# Altium schematic sheet ConnectionMCU.SchDoc
size A3; SheetNumber: 4; SheetTotal: 4
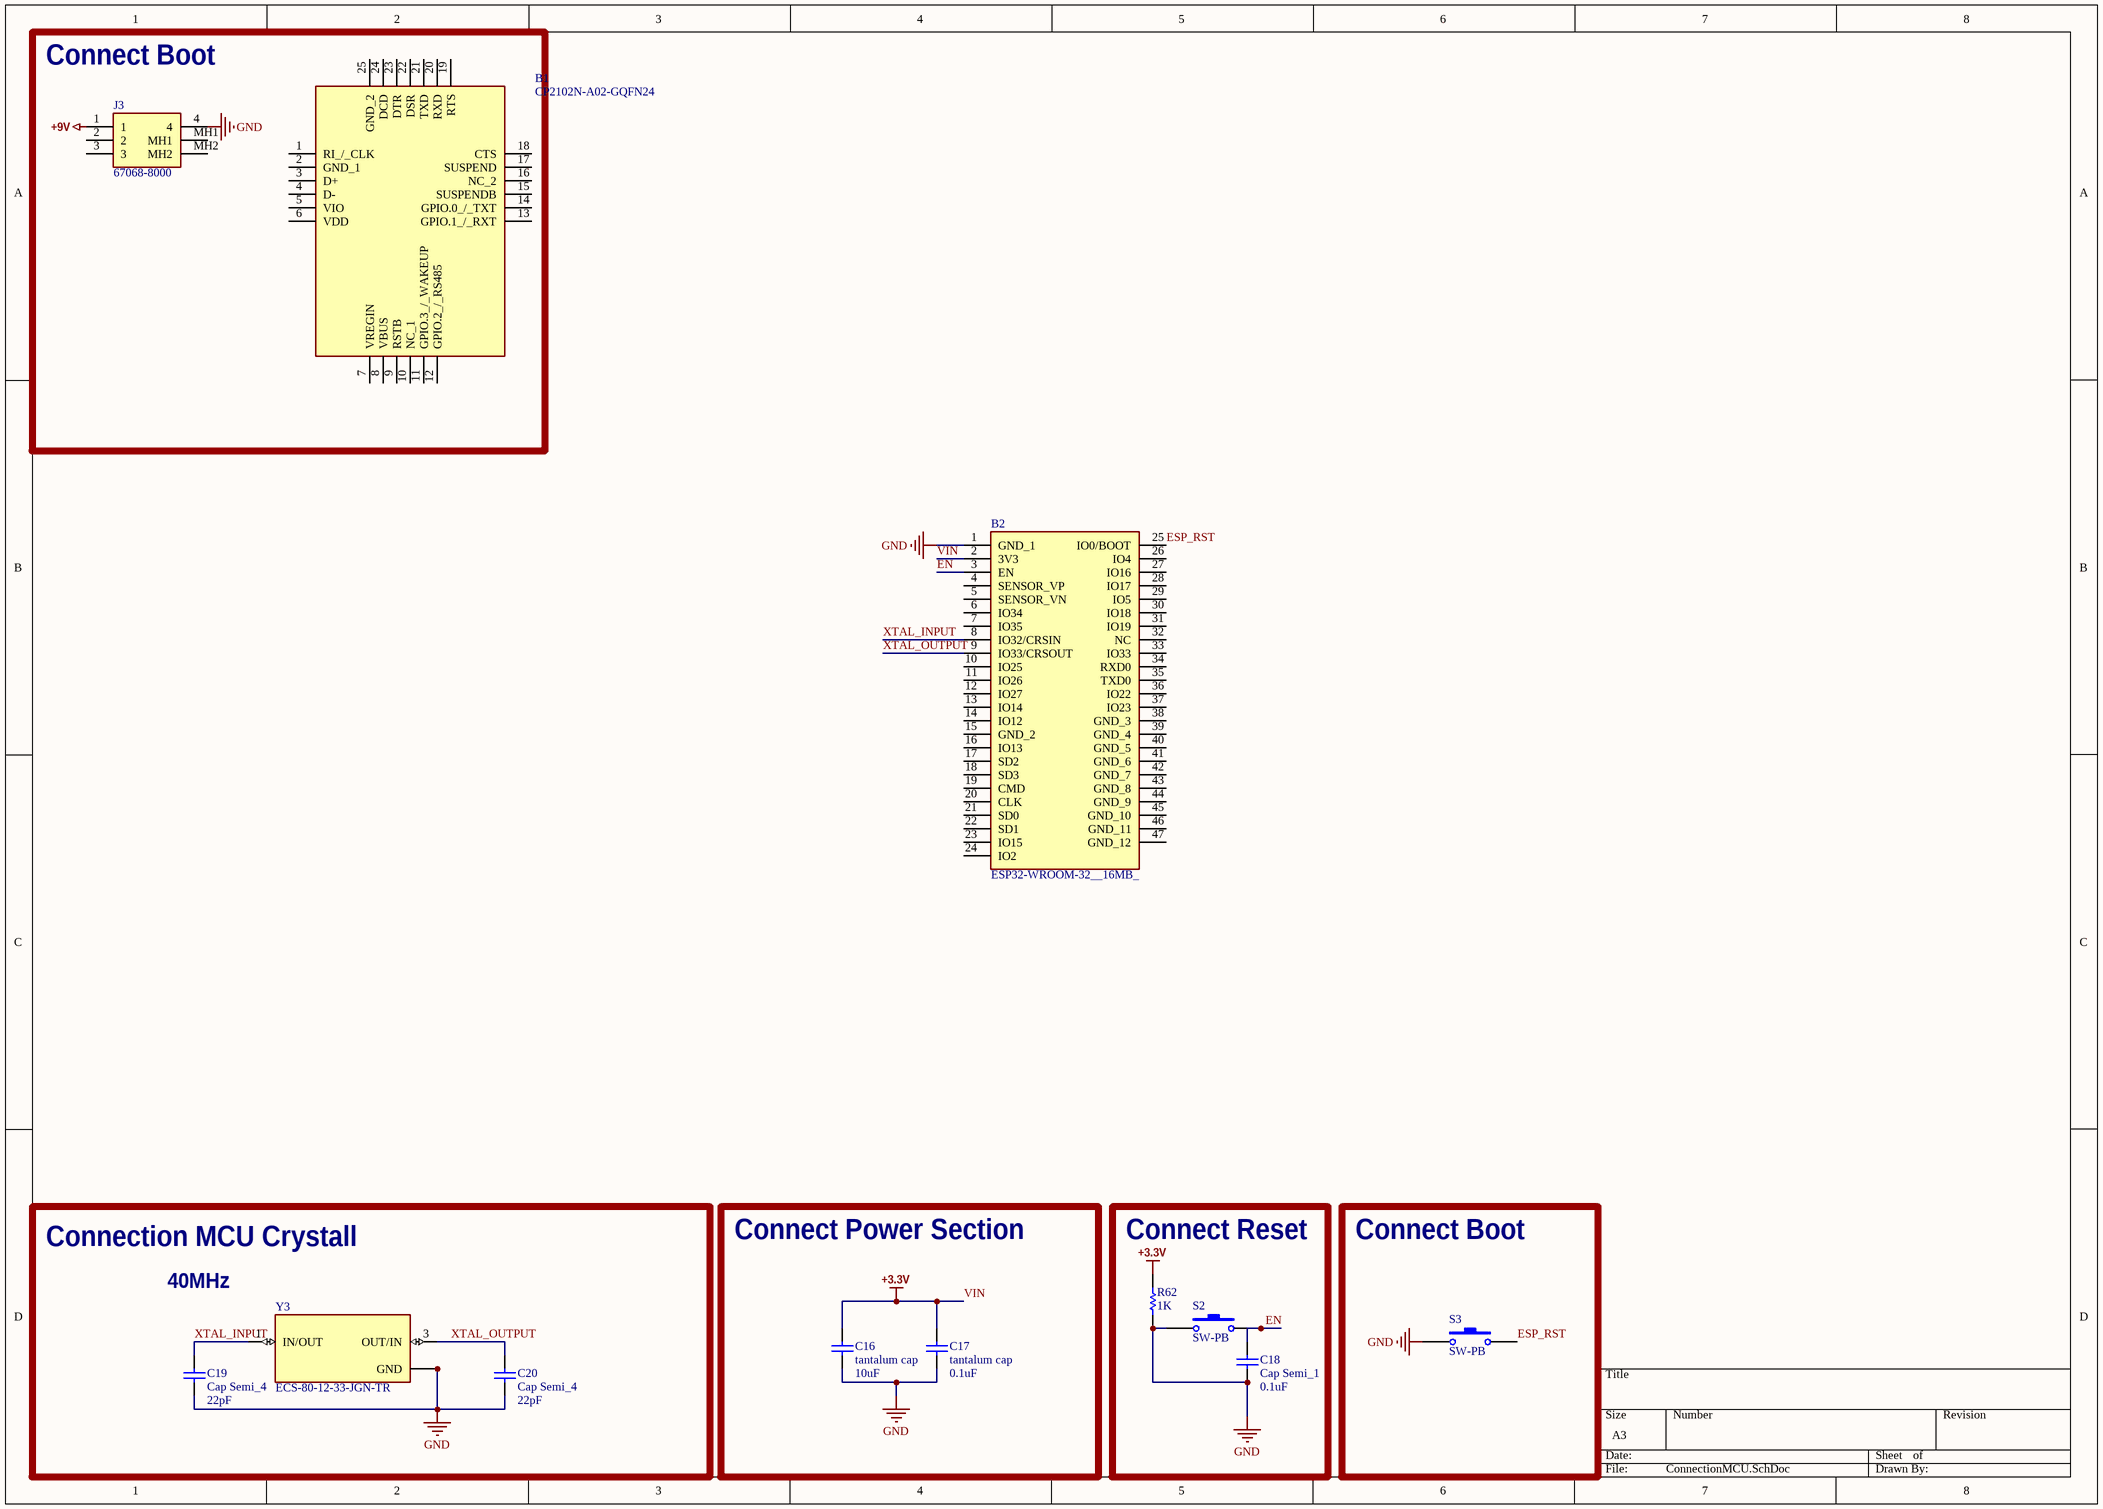
[diagram p0: ConnectionMCU.SchDoc]

## Parts
B1  CP2102N-A02-GQFN24  [QFN50P400X400X80-25N-D]
B2  ESP32-WROOM-32__16MB_  [ESP32WROOM3216MB]
C16  tantalum cap  value 10uF  [C1206tancap]
C17  tantalum cap  value 0.1uF  [C1206tancap]
C18  Cap Semi_1  value 0.1uF  [1608[0603]cap]
C19  Cap Semi_4  value 22pF  [0402cap]
C20  Cap Semi_4  value 22pF  [0402cap]
J3  67068-8000  [670688000]
R62  1K  [MY_0603]
S2  SW-PB  [SPST-2_body]
S3  SW-PB  [SPST-2_body]
Y3  ECS-80-12-33-JGN-TR  [8MHZCrystall]

## Blocks framed on the sheet
Connect Boot: B1 J3
Connection MCU Crystall: C19 C20 Y3
Connect Power Section: C16 C17
Connect Reset: C18 R62 S2
Connect Boot: S3

## Nets
+9V: J3.1
GND: B2.1(GND_1) C16.1 C17.1 C18.1 C19.1 C20.1 J3.4 R62.1 S2.1 S3.1 Y3.2(GND) Y3.4(GND)
VIN: B2.2(3V3) C16.2 C17.2 R62.2  [also labelled +3.3V]
EN: B2.3(EN) C18.2 S2.2
ESP_RST: B2.25(IO0/BOOT) S3.2
XTAL_INPUT: B2.8(IO32/CRSIN) C19.2 Y3.1(IN/OUT)
XTAL_OUTPUT: B2.9(IO33/CRSOUT) C20.2 Y3.3(OUT/IN)

Not connected (* = marked no-connect by the designer): B1 1(RI_/_CLK) 2(GND_1) 3(D+) 4(D-) 5(VIO) 6(VDD) 7(VREGIN) 8(VBUS) 9(RSTB) 10(NC_1) 11(GPIO.3_/_WAKEUP) 12(GPIO.2_/_RS485) 13(GPIO.1_/_RXT) 14(GPIO.0_/_TXT) 15(SUSPENDB) 16(NC_2) 17(SUSPEND) 18(CTS) 19(RTS) 20(RXD) 21(TXD) 22(DSR) 23(DTR) 24(DCD) 25(GND_2); B2 4(SENSOR_VP) 5(SENSOR_VN) 6(IO34) 7(IO35) 10(IO25) 11(IO26) 12(IO27) 13(IO14) 14(IO12) 15(GND_2) 16(IO13) 17(SD2) 18(SD3) 19(CMD) 20(CLK) 21(SD0) 22(SD1) 23(IO15) 24(IO2) 26(IO4) 27(IO16) 28(IO17) 29(IO5) 30(IO18) 31(IO19) 32(NC) 33(IO33) 34(RXD0) 35(TXD0) 36(IO22) 37(IO23) 38(GND_3) 39(GND_4) 40(GND_5) 41(GND_6) 42(GND_7) 43(GND_8) 44(GND_9) 45(GND_10) 46(GND_11) 47(GND_12); J3 2 3 MH1 MH2

## Notes on the sheet
- 40MHz

## Library data of the parts
B1 = CP2102N-A02-GQFN24: USB Interface IC USB to UART bridge - QFN24; Manufacturer_Name: Silicon Labs; Geometry.Height: 0.8mm; Manufacturer_Part_Number: CP2102N-A02-GQFN24; Mouser Part Number: 634-CP2102NA02GQFN24; Mouser Price/Stock: https://www.mouser.co.uk/ProductDetail/Silicon-Labs/CP2102N-A02-GQFN24?qs=u16ybLDytRYKabtL%2FE7DZA%3D%3D; Arrow Part Number: CP2102N-A02-GQFN24; Arrow Price/Stock: https://www.arrow.com/en/products/cp2102n-a02-gqfn24/silicon-labs?region=nac; Datasheet Link: https://componentsearchengine.com/Datasheets/1/CP2102N-A02-GQFN24.pdf
B2 = ESP32-WROOM-32__16MB_: WiFi Modules (802.11); Manufacturer_Name: Espressif Systems; Manufacturer_Part_Number: ESP32-WROOM-32 (16MB); Geometry.Height: 3.2mm; Mouser Part Number: 356-ESPWROOM3216MB; Mouser Price/Stock: https://www.mouser.co.uk/ProductDetail/Espressif-Systems/ESP32-WROOM-32-16MB?qs=w%2Fv1CP2dgqrcPyEPuQvO1A%3D%3D; Arrow Part Number: *; Arrow Price/Stock: *; Datasheet Link: https://www.espressif.com/sites/default/files/documentation/esp32_datasheet_en.pdf
C16 C17 = Cap Semi_6: Capacitor (Semiconductor SIM Model); Published: 8-Jun-2000; LatestRevisionDate: 29-May-2009; LatestRevisionNote: IPC-7351 Footprint Added.; PackageReference: C1206; Publisher: Altium Limited; PackageDescription: Chip Capacitor
C18 = Cap Semi_1: Capacitor (Semiconductor SIM Model); Published: 8-Jun-2000; LatestRevisionDate: 29-May-2009; LatestRevisionNote: IPC-7351 Footprint Added.; PackageReference: C1206; Publisher: Altium Limited; PackageDescription: Chip Capacitor
C19 C20 = Cap Semi_4: Capacitor (Semiconductor SIM Model); Published: 8-Jun-2000; LatestRevisionDate: 29-May-2009; LatestRevisionNote: IPC-7351 Footprint Added.; PackageReference: C1206; Publisher: Altium Limited; PackageDescription: Chip Capacitor
J3 = 67068-8000: USB Connectors USB TYPE B RECEPT. Rt.Angle Gold Flash; Manufacturer_Name: Molex; Geometry.Height: 11mm; Manufacturer_Part_Number: 67068-8000; Mouser Part Number: 538-67068-8000; Mouser Price/Stock: https://www.mouser.co.uk/ProductDetail/Molex/67068-8000?qs=N76qWb2E9MLsLGBiHvIzzg%3D%3D; Arrow Part Number: *; Arrow Price/Stock: *; Datasheet Link: https://www.molex.com/pdm_docs/sd/670688000_sd.pdf
R62 = Res: Standard resistor; ASiD Part Number: Res-AS; Value: 1K
S2 S3 = SW-PB: Switch; Published: 24-Mar-1999; LatestRevisionDate: 17-Jul-2002; LatestRevisionNote: Re-released for DXP Platform.; PackageReference: SPST-2; Publisher: Altium Limited; PackageDescription: Switch; 2 Leads
Y3 = ECS-80-12-33-JGN-TR: 8MHz Â±20ppm Crystal 12pF 400 Ohms 4-SMD, No Lead; Value: 40 MHZ; MF: ECS Inc.; Package: SMD-4 ECS International; MP: ECS-80-12-33-JGN-TR; Availability: Warning; Price: None; SnapEDA_Link: https://www.snapeda.com/parts/ECS-80-12-33-JGN-TR/ECS%20Inc./view-part/4477300/?ref=snap; Mouser-Purchase-URL: https://snapeda.com/shop?store=Mouser&id=4477300; BuyPart: https://www.snapeda.com/parts/ECS-80-12-33-JGN-TR/ECS%20Inc./view-part/4477300/?ref=eda